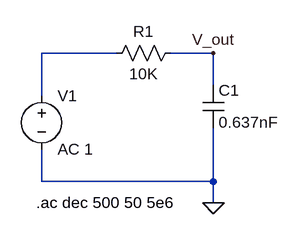
[diagram p0: schematic assig3_q3.asc]
assig3_q3.asc, the LTspice schematic file:
Version 4
SHEET 1 880 680
WIRE 160 64 48 64
WIRE 304 64 240 64
WIRE 304 112 304 64
WIRE 48 128 48 64
WIRE 48 256 48 208
WIRE 304 256 304 176
WIRE 304 256 48 256
WIRE 304 288 304 256
FLAG 304 288 0
FLAG 304 64 V_out
SYMBOL voltage 48 112 R0
SYMATTR InstName V1
SYMATTR Value AC 1
SYMBOL res 256 48 R90
WINDOW 0 0 56 VBottom 2
WINDOW 3 32 56 VTop 2
SYMATTR InstName R1
SYMATTR Value 10K
SYMBOL cap 288 112 R0
SYMATTR InstName C1
SYMATTR Value 0.637nF
TEXT 40 288 Left 2 !.ac dec 500 50 5e6

The netlist it stands for:
* assig3_q3.asc
V1 N001 0 AC 1
R1 V_out N001 10K
C1 V_out 0 0.637nF
.ac dec 500 50 5e6
.backanno
.end